# Altium schematic sheet RS485 Rain Sensor Socket.SchDoc: RS485 Rain Sensor Socket
size 292 x 193 mm; SheetNumber: 16; SheetTotal: 21
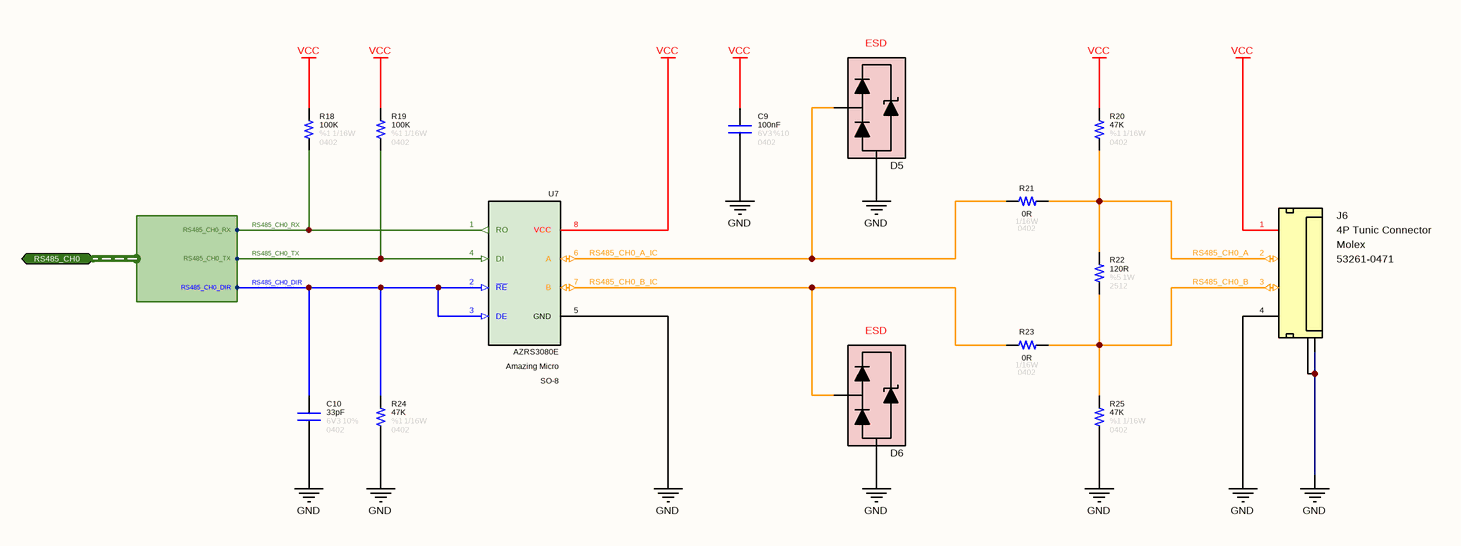
[diagram p0: RS485 Rain Sensor Socket.SchDoc]

## Parts
C9  value 100nF  Tolerance: %10  Voltage: 6V3  Case: 0402  [CAPACITOR_0402]  (hidden comment: Capacitor - 100nF [0402] (Ceramic))
C10  value 33pF  Tolerance: 10%  Case: 0402  Voltage: 6V3  [CAPACITOR_0402]  (hidden comment: Capacitor - 33pF [0402] (Ceramic))
D5  0402ESDA-MLP1  [ESD_0402]  (value not drawn)
D6  0402ESDA-MLP1  [ESD_0402]  (value not drawn)
J6  Manufacturer Name: Molex  Manufacturer Part Number: 53261-0471  [Connector_Tunic 4P]  (hidden comment: 4P SMD Tunic Connector)
R18  value 100K  Tolerance: %1  Case: 0402  Power: 1/16W  [RESISTOR_0402]  (hidden comment: 100K - 0402 - %1 - 1/16W)
R19  value 100K  Tolerance: %1  Case: 0402  Power: 1/16W  [RESISTOR_0402]  (hidden comment: 100K - 0402 - %1 - 1/16W)
R20  value 47K  Tolerance: %1  Case: 0402  Power: 1/16W  [RESISTOR_0402]  (hidden comment: 47K - 0402 - %1 - 1/16W)
R21  value 0R  Case: 0402  Power: 1/16W  [RESISTOR_0402]  (hidden comment: 0R - 0402 - %1 - 1/16W)
R22  value 120R  Tolerance: %5  Case: 2512  Power: 1W  [RESISTOR_2512]  (hidden comment: 120R - 2512 - %5 - 1W)
R23  value 0R  Case: 0402  Power: 1/16W  [RESISTOR_0402]  (hidden comment: 0R - 0402 - %1 - 1/16W)
R24  value 47K  Tolerance: %1  Case: 0402  Power: 1/16W  [RESISTOR_0402]  (hidden comment: 47K - 0402 - %1 - 1/16W)
R25  value 47K  Tolerance: %1  Case: 0402  Power: 1/16W  [RESISTOR_0402]  (hidden comment: 47K - 0402 - %1 - 1/16W)
U7  Case: SO-8  Manufacturer Part Number: AZRS3080E  Manufacturer Name: Amazing Micro  [SOP-8L (AZRS3080E)]  (hidden comment: RS485 Modulator)

## Ports
RS485_CH0 (bidir, harness RS485_CH0)

## Harnesses
RS485_CH0: RS485_CH0_RX, RS485_CH0_TX, RS485_CH0_DIR

## Nets
GND: C9.1 C10.1 D5.2(GND) D6.2(GND) J6.4(Pin-4) J6.5(GND) J6.6(GND) R24.1 R25.1 U7.5(GND)
VCC: C9.2 J6.1(Pin-1) R18.2 R19.2 R20.2 U7.8(VCC)
RS485_CH0_A: J6.2(Pin-2) R20.1 R21.1 R22.2
RS485_CH0_A_IC: D5.1(I/O) R21.2 U7.6(A)
RS485_CH0_B: J6.3(Pin-3) R22.1 R23.1 R25.2
RS485_CH0_B_IC: D6.1(I/O) R23.2 U7.7(B)
RS485_CH0_DIR: C10.2 R24.2 U7.2(~{RE}) U7.3(DE) ; port RS485_CH0.RS485_CH0_DIR
RS485_CH0_RX: R18.1 U7.1(RO) ; port RS485_CH0.RS485_CH0_RX
RS485_CH0_TX: R19.1 U7.4(DI) ; port RS485_CH0.RS485_CH0_TX

## Notes on the sheet
- © 2021 All rights reserved.
  This document may not, in whole or in part, be copied, photocopied, reproduced, translated or converted to any electronic or machine readable from without prior written permission of Mehmet Günce Akkoyun.
  Engineer contact : akkoyun@me.com
- Property of
- Engineer :
- Date :
- Size :
- A4
- Time :
- Project :
- Page :
- /
- Customer :
- Product ID :
- Module ID :
- Version :
- File :
- Revision :
- (in symbol Connector - Mini Tunic 4P (1.25)) 4P Tunic Connector
- (in symbol Diode - TPD1E05U06DPYR) ESD

## Library data of the parts
C9 = Capacitor - 100nF [0402-6V3]: Capacitor - 100nF [0402-6V3] (Ceramic); Manufacturer Name: AVX; Manufacturer Part Number: 04026D104KAT4A; ComponentLink1Description: Mouser; ComponentLink1URL: https://www.mouser.com.tr/ProductDetail/AVX/04026D104KAT4A?qs=sGAEpiMZZMs0AnBnWHyRQPg4iYkCw7IMED%2F4kpqgf7w%3D; ComponentLink2Description: DataSheet; ComponentLink2URL: https://www.mouser.com.tr/datasheet/2/40/cx5r-776519.pdf
C10 = Capacitor - 33pF [0402-6V3]: Manufacturer Name: Kemet; Manufacturer Part Number: C0402C330J9RACAUTO; ComponentLink1Description: DataSheet; ComponentLink1URL: https://api.kemet.com/component-edge/download/datasheet/C0402C330J9RACAUTO.pdf; ComponentLink2Description: Mouser; ComponentLink2URL: https://www.mouser.com/Search/Refine.aspx?Keyword=80-C0402C330J9RAUTO
D5 D6 = Diode - TPD1E05U06DPYR: SUPPRESSOR ESD 30VDC 0402 HFREE; Manufacturer Name: Eaton; Breakdown Voltage: 30V; Capacitance: 0.15pF; Manufacturer Part Number: 0402ESDA-MLP1; Case: 0402
J6 = Connector - Mini Tunic 4P (1.25): Mini Tunic Connector with 4P; Pitch: 1.25mm; Position: 4; ROHS: Yes; ComponentLink1Description: DataSheet; ComponentLink1URL: https://www.mouser.com.tr/datasheet/2/276/0532610471_PCB_HEADERS-170942.pdf; ComponentLink2Description: Mouser; ComponentLink2URL: https://www.mouser.com.tr/ProductDetail/Molex/53261-0471?qs=%2Fha2pyFaduhLhIsk8tywtK7BwWtguBSP4XxyDBTOTfs%3D; Case: SMD
R18 R19 = Resistor - 100K [0402]: Thick Film Resistors - SMD 1/16 W 100 KOhm 1%; Manufacturer Name: Vishay; Manufacturer Part Number: CRCW0402100KFKED; ComponentLink1Description: DataSheet; ComponentLink1URL: https://www.mouser.com.tr/datasheet/2/427/dcrcwe3-1762152.pdf; ComponentLink2Description: Mouser; ComponentLink2URL: https://www.mouser.com.tr/ProductDetail/Vishay-Dale/CRCW040210K0FKED?qs=sGAEpiMZZMu61qfTUdNhG2DpbjADlD3GcalbOv9utCY%3D
R20 R24 R25 = Resistor - 47K [0402]: Thick Film Resistors - SMD 1/16 W 47 KOhm 1%; Manufacturer Name: Vishay; Manufacturer Part Number: CRCW040247K0FKED; ComponentLink1Description: DataSheet; ComponentLink1URL: https://www.mouser.com.tr/datasheet/2/427/dcrcwe3-1762152.pdf; ComponentLink2Description: Mouser; ComponentLink2URL: https://www.mouser.com.tr/ProductDetail/Vishay-Dale/CRCW040247K0FKED?qs=sGAEpiMZZMu61qfTUdNhG2DpbjADlD3GL%252B3h1elTxqU%3D
R21 R23 = Resistor - 0R [0402]: Thick Film Resistors - SMD 1/16 W 0 Ohm; Manufacturer Name: Vishay; Manufacturer Part Number: CRCW04020000Z0ED; ComponentLink1Description: DataSheet; ComponentLink1URL: https://www.mouser.com.tr/datasheet/2/427/dcrcwe3-1762152.pdf; ComponentLink2Description: Mouser; ComponentLink2URL: https://www.mouser.com.tr/ProductDetail/Vishay-Dale/CRCW04020000Z0ED?qs=sGAEpiMZZMu61qfTUdNhG2DpbjADlD3GG34cJb50zyg%3D
R22 = Resistor - 120R [2512]: Thick Film Resistors - SMD 1 W 120 Ohm 5%; Manufacturer Name: YAGEO; Manufacturer Part Number: RC2512JK-07120RL; ComponentLink1Description: DataSheet; ComponentLink1URL: https://www.mouser.com.tr/datasheet/2/447/PYu_RC_Group_51_RoHS_L_11-1984063.pdf
U7 = IC - AZRS3080E: Half-duplex RS485 transceiver.; RoHS: Yes; ComponentLink1Description: DataSheet; ComponentLink1URL: https://www.amazingic.com/common/frontend/download?path=/uploads/images/products/PDF/AZRS/AZRS3080E.pdf